# Altium schematic sheet STM32F4xx.SchDoc
size A4; SheetNumber: 3; SheetTotal: 5
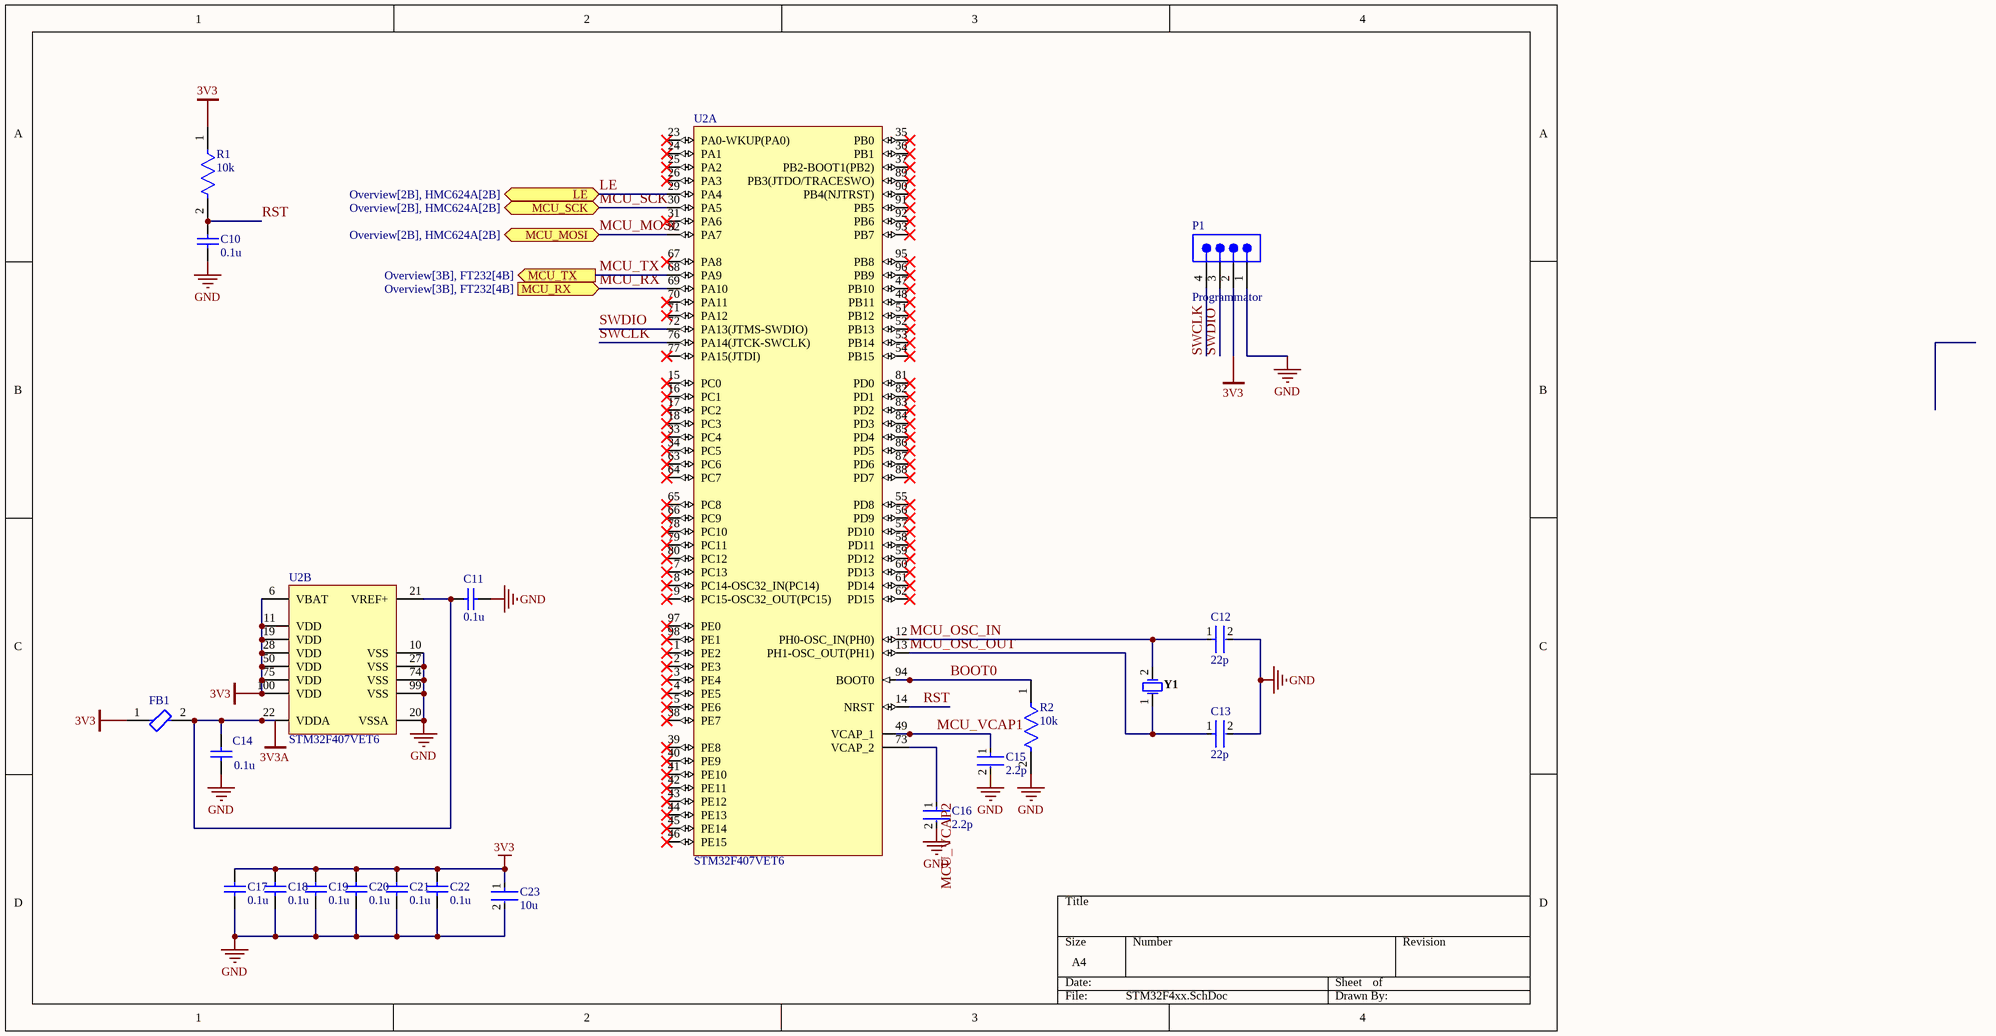
[diagram p0: STM32F4xx.SchDoc]

## Parts
C10  0.1u  [CAPC1608X92X38NL15T08]
C11  0.1u  [CAPC1608X92X38NL15T08]
C12  22p  [FP-C0603C-CF-MFG]
C13  22p  [FP-C0603C-CF-MFG]
C14  0.1u  [CAPC1608X92X38NL15T08]
C15  2.2p  [FP-CC0603-DA-MFG]
C16  2.2p  [FP-CC0603-DA-MFG]
C17  0.1u  [CAPC1608X92X38NL15T08]
C18  0.1u  [CAPC1608X92X38NL15T08]
C19  0.1u  [CAPC1608X92X38NL15T08]
C20  0.1u  [CAPC1608X92X38NL15T08]
C21  0.1u  [CAPC1608X92X38NL15T08]
C22  0.1u  [CAPC1608X92X38NL15T08]
C23  10u  [FP-GRM21B-0_2-e0_2_0_7-MFG]
FB1  BLM21PG600BH1D  [FP-BLM21-0_2-t0_85-e0_5-IPC_C]  (value not drawn)
P1  Programmator  [SMTC-TSW-104-08-X-S]
R1  10k  [FP-AC0603-IPC_A]
R2  10k  [FP-AC0603-IPC_A]
U2  STM32F407VET6  [STM-LQFP100_M]  (parts A,B of 2)
Y1  NX3225GD-8MHZ-STD-CRA-3  [NDK-NX3225GD-8MHZ-STD-CRA-3_V]  (value not drawn)

## Ports
LE (bidir, see Overview[2B], HMC624A[2B]), MCU_MOSI (bidir, see Overview[2B], HMC624A[2B]), MCU_RX (in, see Overview[3B], FT232[4B]), MCU_SCK (bidir, see Overview[2B], HMC624A[2B]), MCU_TX (out, see Overview[3B], FT232[4B])

## Nets
3V3: C17.2 C18.2 C19.2 C20.2 C21.2 C22.2 C23.1 FB1.1 P1.2 R1.1 U2.6(VBAT) U2.11(VDD) U2.19(VDD) U2.28(VDD) U2.50(VDD) U2.75(VDD) U2.100(VDD)
3V3A: C11.2 C14.2 FB1.2 U2.21(VREF+) U2.22(VDDA)
GND: C10.1 C11.1 C12.2 C13.2 C14.1 C15.2 C16.2 C17.1 C18.1 C19.1 C20.1 C21.1 C22.1 C23.2 P1.1 R2.2 U2.10(VSS) U2.20(VSSA) U2.27(VSS) U2.74(VSS) U2.99(VSS)
BOOT0: R2.1 U2.94(BOOT0)
LE: U2.29(PA4) ; port LE
MCU_MOSI: U2.32(PA7) ; port MCU_MOSI
MCU_OSC_IN: C12.1 U2.12(PH0-OSC_IN(PH0)) Y1.2
MCU_OSC_OUT: C13.1 U2.13(PH1-OSC_OUT(PH1)) Y1.1
MCU_RX: U2.69(PA10) ; port MCU_RX
MCU_SCK: U2.30(PA5) ; port MCU_SCK
MCU_TX: U2.68(PA9) ; port MCU_TX
MCU_VCAP1: C15.1 U2.49(VCAP_1)
MCU_VCAP2: C16.1 U2.73(VCAP_2)
RST: C10.2 R1.2 U2.14(NRST)
SWCLK: P1.4 U2.76(PA14(JTCK-SWCLK))
SWDIO: P1.3 U2.72(PA13(JTMS-SWDIO))

Not connected (* = marked no-connect by the designer): U2 1(PE2)* 2(PE3)* 3(PE4)* 4(PE5)* 5(PE6)* 7(PC13)* 8(PC14-OSC32_IN(PC14))* 9(PC15-OSC32_OUT(PC15))* 15(PC0)* 16(PC1)* 17(PC2)* 18(PC3)* 23(PA0-WKUP(PA0))* 24(PA1)* 25(PA2)* 26(PA3)* 31(PA6)* 33(PC4)* 34(PC5)* 35(PB0)* 36(PB1)* 37(PB2-BOOT1(PB2))* 38(PE7)* 39(PE8)* 40(PE9)* 41(PE10)* 42(PE11)* 43(PE12)* 44(PE13)* 45(PE14)* 46(PE15)* 47(PB10)* 48(PB11)* 51(PB12)* 52(PB13)* 53(PB14)* 54(PB15)* 55(PD8)* 56(PD9)* 57(PD10)* 58(PD11)* 59(PD12)* 60(PD13)* 61(PD14)* 62(PD15)* 63(PC6)* 64(PC7)* 65(PC8)* 66(PC9)* 67(PA8)* 70(PA11)* 71(PA12)* 77(PA15(JTDI))* 78(PC10)* 79(PC11)* 80(PC12)* 81(PD0)* 82(PD1)* 83(PD2)* 84(PD3)* 85(PD4)* 86(PD5)* 87(PD6)* 88(PD7)* 89(PB3(JTDO/TRACESWO))* 90(PB4(NJTRST))* 91(PB5)* 92(PB6)* 93(PB7)* 95(PB8)* 96(PB9)* 97(PE0)* 98(PE1)*

## Library data of the parts
C10 C11 C14 C17-C22 = CMP-2006-01166-1: Manufacturer: Vitramon; Part Number: VJ0603Y104KXXAP
C12 C13 = CMP-03020-026609-1: C0603 22 pF X7R 30ppm/°C 10.00% 100 V; Manufacturer Part Number: C0603C220K1RACAUTO; Manufacturer: KEMET; Voltage Rating: 100 V; Value: 22 pF; Tolerance: 0.1; Material: Ceramic; Automotive Grade: Grade 1; Device Class L3: Ceramic Capacitors; Temperature Range High: +125°C; Height: 0.87mm; Temperature Coefficient: 30ppm/°C; Automotive: Yes; Octopart: https://octopart.com/c0603c220k1racauto-kemet-91893838; Device Class L2: Capacitors; RoHS: TRUE; Lead Free: Yes; Category: Cap; Capacitance: 22 pF; ComponentLink2Description: Datasheet; Package: C0603C-CF; Device Class L1: Passive Components; Temperature: -55°C to +125°C; Temperature Characteristic: X7R; ComponentLink2URL: https://api.kemet.com/component-edge/download/datasheet/C0603C100J5GACAUTO.pdf; Temperature Range Low: -55°C
C15 C16 = CMP-03422-000630-1: CC0603 2.2 uF X7R 10.00% 10 V; Manufacturer Part Number: CC0603KPX7R6BB225; Manufacturer: YAGEO; Value: 2.2 uF; Tolerance: 0.1; Voltage Rating: 10 V; Temperature Coefficient: 15%; Material: Ceramic; Automotive: No; ComponentLink2URL: http://www.yageo.com/documents/recent/UPY-GPHC_X7R_6.3V-to-50V_18.pdf; Temperature Range Low: -55°C; Package: CC0603-DA; Lead Free: Yes; RoHS: TRUE; Height: 0.9mm; Octopart: https://octopart.com/cc0603kpx7r6bb225-yageo-88116733; ComponentLink2Description: Datasheet; Category: Cap; Device Class L1: Passive Components; Temperature: -55°C to +125°C; Footprint Url: http://www.yageo.com/exep/pages/download/literatures/UPY-C_GEN_24.pdf; Voltage: 10 V; Temperature Range High: +125°C; Device Class L3: Ceramic Capacitors; Capacitance: 2.2 uF; Device Class L2: Capacitors; Temperature Characteristic: X7R
C23 = CMP-06035-044754-1: Chip Multilayer Ceramic Capacitors for General Purpose, 0805, 10uF, X5R, 15%, 20%, 50V
FB1 = CMP-06046-002606-1: Chip Ferrite Bead, 0805, 60Ω @ 100MHz, 0.02Ω, 25%, 1.9A; RoHS Compliant: No
P1 = CMP-1024-00357-1: 0.025" SQ Post Header, Through-hole, Vertical, -55 to 125 degC, 2.54 mm Pitch, 4-Pin, Male, RoHS; Manufacturer: Samtec; PartNumber: TSW-104-08-G-S; Pitch: 2.54 mm; RoHS: True; ComponentLink3URL: http://www.samtec.com/documents/webfiles/cpdf/TSW-XXX-XX-XXX-X-XX-XXX-MKT.pdf; Mounting Technology: Through-hole; ComponentLink2URL: http://www.samtec.com/documents/webfiles/pdf/TSW_TH.PDF; ComponentLink1URL: http://www.samtec.com; ComponentLink3Description: Package Specification; PackageVersion: DM, 8/1988; ComponentLink2Description: Datasheet; PackageReference: TSW-104-08-X-S; PackageDescription: .025[0.64] SQ. Post Terminal Strip Assembly; ComponentLink1Description: Manufacturer URL; Temperature Range: -55 to 125 degC; DatasheetVersion: F-214; Orientation: Vertical
R1 R2 = CMP-03412-040683-1: RES 10kΩ 5.00% 0.2W 0603
U2 = CMP-0243-00016-3: ARM Cortex-M4 32-bit MCU+FPU, 210 DMIPS, 512 kB Flash, 192 kB Internal RAM, 82 I/Os, 100-pin LQFP, -40 to 85 degC, Tray; Manufacturer: STMicroelectronics; Supply Voltage(Vcc) max (V): 3.6; Supply Voltage(Vcc) min (V): 1.8; I/Os (High Current): 82; FLASH Size (Prog) (kB): 512; Operating Frequency(F) (Processor speed) (MHz): 168; D/A Converter: 2x12-bit; Internal RAM Size (kB): 192; PackageReference: LQFP100; Core: ARM Cortex-M4; ComponentLink1URL: http://www.st.com/web/en/home.html; ComponentLink1Description: Manufacturer URL; DatasheetVersion: Rev. 4; Packing: Tray; Mounting Technology: Surface Mount; ComponentLink2Description: Datasheet; ComponentLink2URL: http://www.st.com/st-web-ui/static/active/en/resource/technical/document/datasheet/DM00037051.pdf; ComponentLink3Description: Package Specification; PartNumber: STM32F407VET6; PackageVersion: Rev. 1, 06/2013; PackageDescription: 100-Pin Low Profile Quad Flat Package, 14 x 14 mm Body, 0.5 mm Pitch; ComponentLink3URL: http://www.st.com/st-web-ui/static/active/en/resource/technical/document/data_brief/DM00071938.pdf
Y1 = CMP-2000-07595-1: Crystal Unit, 8 MHz, 8 pF, -40 to 150 degC, 2-Pin SMD, RoHS, Tape and Reel; Manufacturer: NDK; Load Capacitance: 8pF; ESR (Equivalent Series Resistance): 500Ohm; Frequency Tolerance: 50ppm; Frequency Stability: 150ppm; Frequency: 8MHz; Case/Package: SMD/SMT; Datasheet Version: 11/2016; Min Operating Temperature: -40degC; Packaging: TapeandReel; Width: 0.098inch; Package Quantity: 3000; Number of Pins: 2; Package Description: 2-Pin Surface Mount Device, Body 3.2 x 2.5 mm; RoHSCompliant: True; Package Reference: NX3225GD-8MHZ-STD-CRA-3; Datasheet URL: http://www.ndk.com/images/products/catalog/c_NX3225GD-STD-CRA-3_e.pdf; Mounting Technology: SurfaceMount; Length: 0.126inch; Mount: SurfaceMount; Manufacturer URL: http://www.ndk.com/en/; Max Operating Temperature: 150degC; Height: 0.039inch